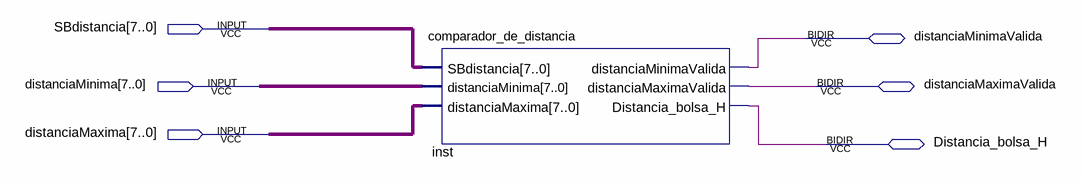
[diagram p0: schematic sheet]
// Quartus schematic bloqueComparadorDistancia.bdf as structural Verilog: 1 symbols, 6 pins
module bloqueComparadorDistancia (
  input  [7:0] SBdistancia,
  input  [7:0] distanciaMinima,
  input  [7:0] distanciaMaxima,
  inout  distanciaMinimaValida,
  inout  distanciaMaximaValida,
  inout  Distancia_bolsa_H
);

  comparador_de_distancia inst (
    .SBdistancia(SBdistancia), .distanciaMinima(distanciaMinima), .distanciaMaxima(distanciaMaxima),
    .distanciaMinimaValida(distanciaMinimaValida), .distanciaMaximaValida(distanciaMaximaValida),
    .Distancia_bolsa_H(Distancia_bolsa_H));
endmodule
